# EAGLE design USB-nano (EAGLE 9.3.2)
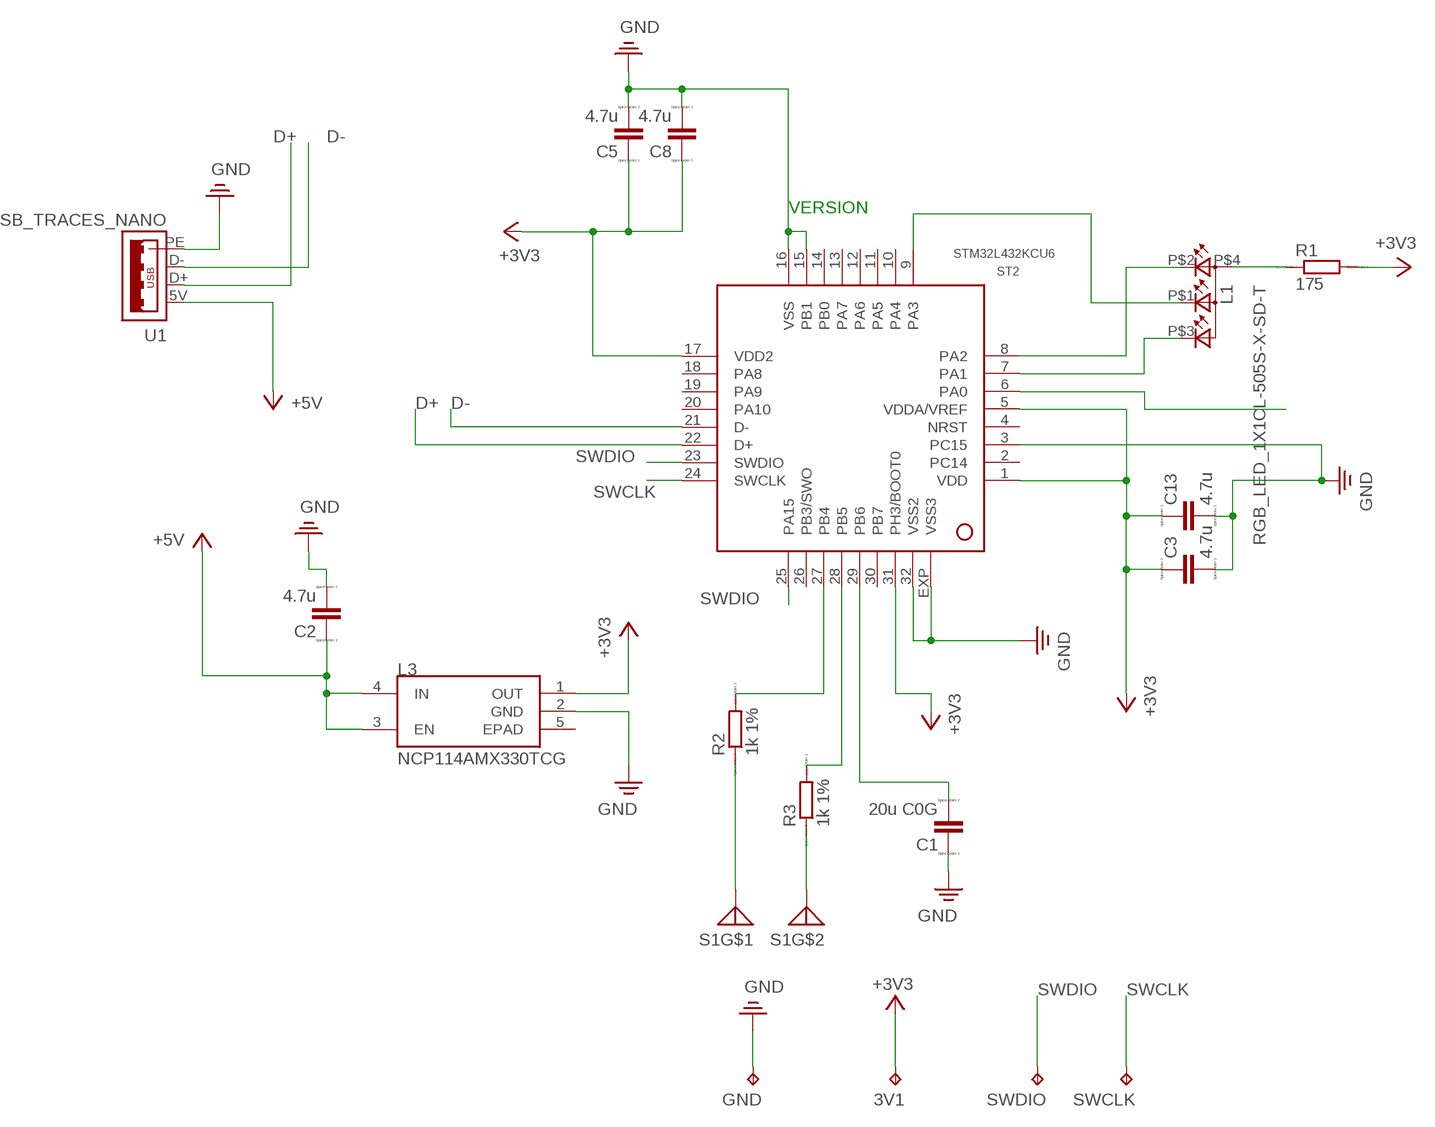
[diagram p0: schematic, sheet 1]

## Parts
3V1  TEST_POINT  [B1,27]
C1  20u C0G  CAPACITOR  [C0402]
C2  4.7u  CAPACITOR  [C0402]
C3  4.7u  CAPACITOR  [C0402]
C5  4.7u  CAPACITOR  [C0402]
C8  4.7u  CAPACITOR  [C0402]
C13  4.7u  CAPACITOR  [C0402]
GND  TEST_POINT  [B1,27]
L1  RGB_LED_1X1CL-505S-X-SD-T  [CL-505S-X-SD-T]
L3  NCP114AMX330TCG  [REG_NCP114AMX330TCG]
R1  175  RESISTOR  [R0402]
R2  1k 1%  RESISTOR  [R0402]
R3  1k 1%  RESISTOR  [R0402]
S1  TOUCH_SENSOR  [SOMU_CAPACITIVE_TOUCH_PAD]
ST2  STM32L432KCU6  [QFN32]
SWCLK  TEST_POINT  [B1,27]
SWDIO  TEST_POINT  [B1,27]
U1  USB_TRACES_NANO  [USB_TRACES_NANO]

## Nets
+3V3: 3V1.TP C3.1 C5.1 C8.1 C13.1 L3.1(OUT) R1.2 ST2.1(VDD) ST2.5(VDDA/VREF) ST2.17(VDD2) ST2.31(PH3/BOOT0)
+5V: C2.1 L3.3(EN) L3.4(IN) U1.5V
D+: ST2.22(D+) U1.D+
D-: ST2.21(D-) U1.D-
N$1: L1.P$4(A2) R1.1
N$2: R2.1 S1.P$1 S1.SENSE
N$3: R2.2 ST2.27(PB4)
N$4: C1.2 ST2.29(PB6)
N$5: R3.1 S1.P$2 S1.SENSE2
N$6: R3.2 ST2.28(PB5)
N$10: L1.P$2(CRED) ST2.8(PA2)
N$13: L1.P$1(CBLUE) ST2.9(PA3)
N$14: L1.P$3(CGREEN) ST2.7(PA1)
N$15: ST2.6(PA0)
PE: C1.1 C2.2 C3.2 C5.2 C8.2 C13.2 GND.TP L3.2(GND) ST2.3(PC15) ST2.15(PB1) ST2.16(VSS) ST2.32(VSS2) ST2.EXP(VSS3) U1.PE ; supply symbol labelled GND
SWCLK: ST2.24(SWCLK) SWCLK.TP
SWDIO: ST2.23(SWDIO) ST2.25(PA15) SWDIO.TP
Unconnected: L3.5(EPAD) ST2.2(PC14) ST2.4(NRST) ST2.10(PA4) ST2.11(PA5) ST2.12(PA6) ST2.13(PA7) ST2.14(PB0) ST2.18(PA8) ST2.19(PA9) ST2.20(PA10) ST2.26(PB3/SWO) ST2.30(PB7)

## Notes on the sheet
- VERSION

## Library data of the parts
3V1 GND SWCLK SWDIO = efm-fido:TEST_POINT
C1-C3 C5 C8 C13 = efm-fido:CAPACITOR
L1 = efm-fido:RGB_LED_1X1: EAST1616RGBA3
L3 = efm-fido:NCP114AMX330TCG: CMOS Low Dropout Regulator, 300 mA 3.3V, Active Discharge; AVAILABILITY: Unavailable; DESCRIPTION: CMOS Low Dropout Regulator _LDO_, 300 mA 3.3V, Active Discharge; MF: ON Semiconductor; MP: NCP114AMX330TCG; PACKAGE: UDFN-4 ON Semiconductor; PRICE: None
R1-R3 = efm-fido:RESISTOR
S1 = efm-fido:TOUCH_SENSOR
ST2 = efm-fido:STM32L432KCU6
U1 = efm-fido:USB_TRACES_NANO

## Net classes
0 default: width 0.152 mm, drill 0.203 mm, clearance 0.102 mm
1 nfc: width 0.089 mm, drill 0.203 mm, clearance 0.089 mm

## Board
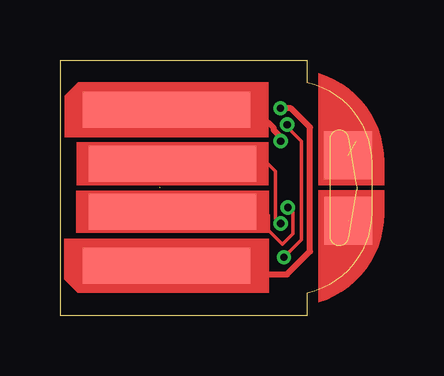
[diagram p1: board, top side]
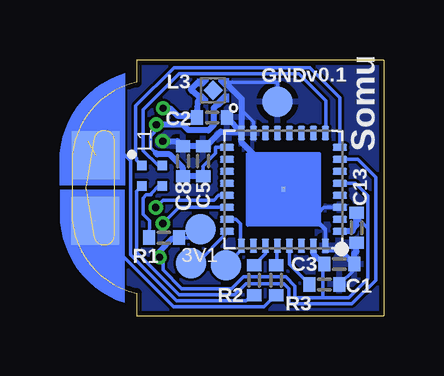
[diagram p2: board, bottom side, seen from below]

Size 13 x 10.65 mm. Coordinates in mm from the lower left corner, seen from the top.
Outline: 10.3,0 0,0 0,10.65 10.3,10.65 10.3,9.72 arc-77 13,6.35 13,4.3 arc-77 10.3,0.93 10.3,0
Outline: 12.04,3.26 12.39,5.24 arc20 12.39,5.41 12.04,7.39 arc170 11.25,7.32 11.25,3.32 arc170 12.04,3.26
Copper layers (1*16): Top 0.035mm / dielectric 0.93mm / Bottom 0.035mm
Design rules "default *": minimum track width 4mil, minimum drill 0.2mm, track to track 4mil, track to pad 4mil, pad to pad 4mil, via to via 5mil, smd to smd 4mil, copper to edge 8mil, drill to drill 6mil, minimum pad ring 10mil, minimum via ring 0.15mm, stop-mask expansion 4mil, vias tented up to drill 0.35mm, thermal gap 10mil
bRestrict: area 2.2,6.9 to 5.4,7.2; area 2.2,4.7 to 2.5,6.9; area 2.3,3.9 to 2.5,4.3; area 2.9,3.3 to 5.8,3.5; area 5.9,4.1 to 6.2,7; area 5.8,4.9 to 6,5.6; area 4,6.8 to 4.4,7; area 4,3.5 to 4.3,3.7; area 2.4,5 to 2.6,5.5; area 10.5,9.8 to 10.7,10.8; area 10.5,-0.5 to 10.9,0.8

### Footprints (pad centres in the part's own frame; a part is rotated, then mirrored left to right if it is on the bottom)
B1,27 = smd 1.27 x 1.27: TP 0,0
C0402 = smd 0.5 x 0.6: 1 -0.625,0; 2 0.625,0
CL-505S-X-SD-T = smd 0.4 x 0.4: P$1 0.85,0; P$2 0.85,0.85; P$3 0,0.85; P$4 0,0
REG_NCP114AMX330TCG = smd 0.1 x 0.1: 1 -0.325,-0.5; 2 0.325,-0.5; 3 0.325,0.5; 4 -0.325,0.5 | smd 0.58 x 0.58 rotated 45: 5 0,0
R0402 = smd 0.5 x 0.6: 1 -0.625,0; 2 0.625,0
SOMU_CAPACITIVE_TOUCH_PAD = smd 2 x 2 bottom: P$1 18.563,3.122; P$2 18.552,5.849 | smd 2 x 2: SENSE 18.563,3.122; SENSE2 18.552,5.849
QFN32 = smd 0.6 x 0.3: 1 -2.35,1.75; 2 -2.35,1.25; 3 -2.35,0.75; 4 -2.35,0.25; 5 -2.35,-0.25; 6 -2.35,-0.75; 7 -2.35,-1.25; 8 -2.35,-1.75; 17 2.35,-1.75; 18 2.35,-1.25; 19 2.35,-0.75; 20 2.35,-0.25; 21 2.35,0.25; 22 2.35,0.75; 23 2.35,1.25; 24 2.35,1.75 | smd 0.3 x 0.6: 9 -1.75,-2.35; 10 -1.25,-2.35; 11 -0.75,-2.35; 12 -0.25,-2.35; 13 0.25,-2.35; 14 0.75,-2.35; 15 1.25,-2.35; 16 1.75,-2.35; 25 1.75,2.35; 26 1.25,2.35; 27 0.75,2.35; 28 0.25,2.35; 29 -0.25,2.35; 30 -0.75,2.35; 31 -1.25,2.35; 32 -1.75,2.35 | smd 0.2 x 0.2: EXP 0,0
USB_TRACES_NANO = smd 7 x 1.5: 5V 0.9,3.25; D+ 0.65,-1; D- 0.65,1; PE 0.9,-3.25

### Placement (x,y rotation side)
3V1  7.64,3.61 0 bottom
C1  2.47,1.3 180 bottom
C2  7.15,8.26 0 bottom
C3  1.85,2.15 0 bottom
C5  7.53,6.44 90 bottom
C8  8.37,6.44 90 bottom
C13  1.13,3.66 270 bottom
GND  4.43,8.91 0 bottom
L1  9.23,5.41 90 bottom
L3  7.11,9.39 90 bottom
R1  9.17,3.25 0 bottom
R2  5.4,1.48 90 bottom
R3  4.48,1.48 90 bottom
S1  30.58,9.8 180 top
ST2  4.18,5.26 180 bottom
SWCLK  8.04,2.19 0 bottom
SWDIO  6.57,2.1 0 bottom
U1  5.36,5.32 180 top

### Tracks (layer width: path | path; a pad name or v marks a point on that pad's centre or on a via)
+3V3  (via drill 0.3)
  Top 0.152: v9.48,7.96 9.43,7.91 10.08,7.26 10.08,3.17 v9.34,2.43
  Bottom 0.152: v9.48,7.96 9.58,7.96 9.58,7.61 9.71,7.48 9.71,6.99 9.49,6.77 | C5.1 7.53,6.22 7.01,6.77 7.01,7.01 ST2.17 | 3V1.TP 8,3.25 R1.2 | 0.65,3.63 0.65,1.53 1.44,0.74 2.52,0.74 2.52,2.1 C3.1 | C13.1 1.11,4.09 0.65,3.63 | 0.65,3.63 0.65,4.99 1.18,5.52 1.19,5.51 ST2.5 | v9.34,2.43 9.2,2.29 9.2,1.9 8.42,1.12 6.34,1.12 5.85,1.62 4.08,1.62 3.7,1.23 3.7,0.74 2.47,0.74
  Bottom 0.254: C5.1 C8.1 8.37,6.16 8.92,6.71 9.44,6.71 9.49,6.77 | C3.1 2.93,2.57 ST2.31 | R1.2 8.6,3.21 8.79,3.21 9.34,2.66 v9.34,2.43 | ST2.1 1.81,3.53 1.3,3.53 1.13,3.78 C13.1 | L3.1 6.88,8.79 6.94,8.79 7.08,8.65 7.08,7.95 7.31,7.72 7.32,7.73 8.14,7.73 8.37,7.95 v9.47,7.95 v9.48,7.96
+5V  (via drill 0.3)
  Top 0.152: 4.51,2.07 U1.5V 7.68,2.07 8.03,1.72
  Top 0.254: 8.03,1.72 9.48,1.72 10.44,2.68 10.44,7.84 9.64,8.64 v9.2,8.64
  Bottom 0.152: L3.3 7.74,9.71 | 8.04,9.41 7.99,9.36 7.65,9.02
  Bottom 0.254: 7.65,9.02 7.75,8.92 C2.1 7.8,8.31 8.57,8.31 8.9,8.64 v9.2,8.64 | L3.4 7.99,9.36 | 7.74,9.71 8.04,9.41
D+  (via drill 0.3)
  Top 0.152: v9.21,3.84 8.99,4.06 8.99,6.01 8.67,6.32 U1.D+
  Bottom 0.152: ST2.22 8.54,4.51 v9.21,3.84
D-  (via drill 0.3)
  Top 0.152: v9.51,4.51 9.52,4.51 9.71,4.32 9.71,3.4 9.28,2.97 8.7,3.55 8.7,4.19 8.57,4.32 U1.D-
  Bottom 0.152: ST2.21 6.88,5.01 7.08,4.81 9.21,4.81 v9.51,4.51
N$1
  Bottom 0.152: R1.1 9.77,3.95 10.04,4.22 10.04,4.89 9.91,5.03 9.7,5.03 9.7,5.09 9.38,5.41 L1.P$4
N$2  (2 unrouted)
  Bottom 0.152: R2.1 5.49,0.85 5.73,0.62 8.63,0.62 10.55,2.53 10.55,6.45 10.97,6.87 10.97,7.61 11.37,8.01 11.68,8.01 11.68,8 11.94,8 12.35,7.59 12.35,7.27
N$3
  Bottom 0.152: R2.2 4.93,2.57 ST2.27
N$4
  Bottom 0.152: C1.2 3.93,2.13 ST2.29
N$5  (1 unrouted)
  Bottom 0.152: R3.1 4.5,0.85 4.99,0.36 8.76,0.36 11.04,2.64 | 11.12,2.72 11.24,2.9 | 11.24,2.9 11.38,3.13 11.38,2.88 | 11.04,2.64 11.24,2.84 11.24,2.9 | 11.04,2.64 11.93,2.64 12.17,2.89 12.11,2.96 12.11,3.87 S1.P$2
N$6
  Bottom 0.152: R3.2 ST2.28
N$10
  Bottom 0.152: ST2.8 1.83,9.08 3.08,10.33 8.75,10.33 10.33,8.74 10.33,6.59 10.29,6.55 10.29,6.47 L1.P$2
N$13
  Bottom 0.152: ST2.9 2.4,7.63 2.4,8.94 3.53,10.07 8.53,10.07 10.03,8.58 10.03,6.88 9.41,6.26 L1.P$1
N$14
  Bottom 0.152: ST2.7 1.07,6.51 0.33,5.77 0.33,1.47 1.31,0.49 3.94,0.49 3.95,0.5 3.95,1.13 4.15,1.33 5.75,1.33 6.21,0.87 8.53,0.87 10.29,2.64 10.29,5.19 L1.P$3
PE  (via drill 0.3)  (1 unrouted)
  Top 0.152: 4.86,8.12 4.66,8.32 4.66,8.52 4.61,8.57 U1.PE 5.55,8.27
  Top 0.254: v9.21,7.27 9.21,7.44 8.92,7.73 8.92,7.82 8.48,8.27 6.08,8.27 | 6.08,8.27 5.55,8.27 | 6.08,8.27 5.5,8.84 5.83,9.17 5.78,9.17 5.78,9.12 5.58,8.92
  Bottom 0.152: 2.43,2.77 ST2.32 | ST2.32 2.43,3.62 2.7,3.89 | 2.7,3.89 2.7,4.3 2.49,4.51 ST2.3 | 2.7,3.89 2.7,3.83 3.7,3.83 3.7,5.12 | 3.73,5.26 3.7,5.23 3.7,5.12 | 4.15,5.34 3.92,5.34 3.7,5.12 | 6.73,9.73 4.43,9.73 GND.TP | ST2.15 5.43,8.07 5.93,8.57 | ST2.32 2.43,3.56 2.67,3.81 2.7,3.89 | C1.1 1.22,1.92 C3.2
  Bottom 0.254: 4.18,5.32 ST2.EXP 4.23,5.52 5.93,7.22 ST2.16 | 4.15,5.04 4.15,5.34 | C5.2 C8.2 8.6,7.27 v9.21,7.27 | C5.2 7.51,7.04 | 2.43,2.77 1.88,2.77 C3.2 1.22,2.58 1.13,2.68 C13.2 | C5.2 7.43,7.04 6.8,7.67 5.99,7.67 ST2.16 | L3.2 5.93,9.03 5.93,8.57 ST2.16 | C2.2 5.93,7.64 ST2.16
  pour Bottom: -0.02,10.68 10.73,10.68 10.78,0.03 -0.02,0.03
SWCLK
  Bottom 0.152: SWCLK.TP 7.79,2.19 6.53,3.45 ST2.24
SWDIO
  Bottom 0.152: ST2.23 6.17,4.01 5.98,3.82 5.98,2.96 ST2.25 5.93,2.74 SWDIO.TP

### Text on the board
bPlace: Somu
bNames: v0.1
comments: Import DXF at -1 scale, 30X, 20Y / Outlines at 0.001mm